# Altium schematic sheet i2c_diff.SchDoc
size A
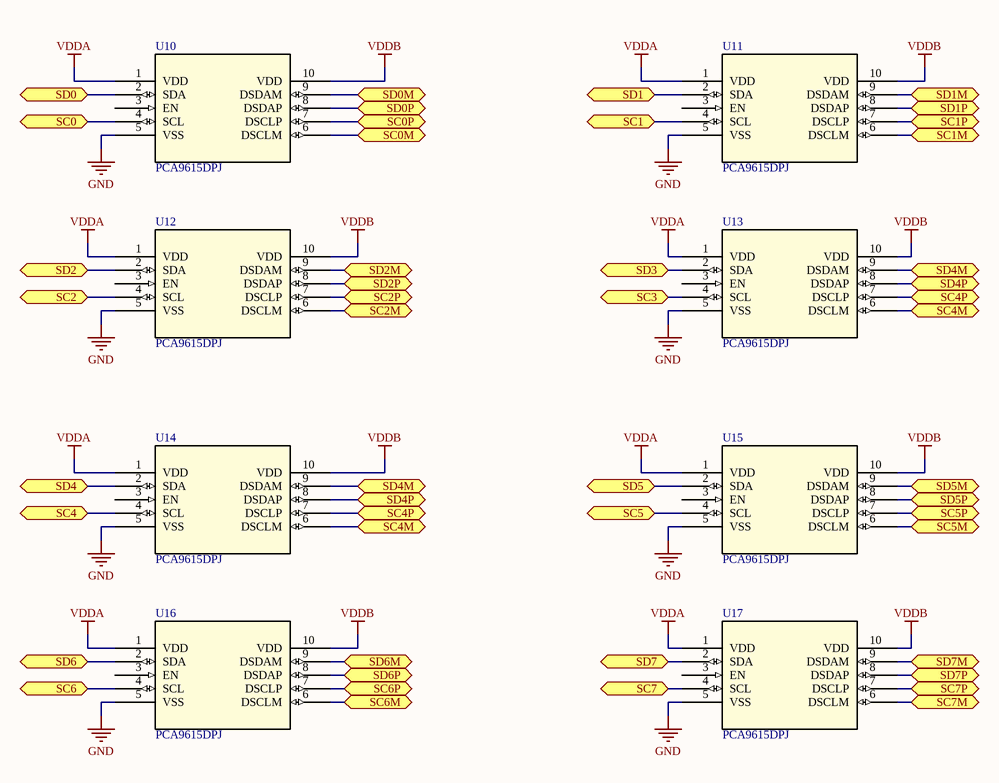
[diagram p0: i2c_diff.SchDoc]

## Parts
U10  PCA9615DPJ  [TSSOP10_3P1X3P1_NXP]
U11  PCA9615DPJ  [TSSOP10_3P1X3P1_NXP]
U12  PCA9615DPJ  [TSSOP10_3P1X3P1_NXP]
U13  PCA9615DPJ  [TSSOP10_3P1X3P1_NXP]
U14  PCA9615DPJ  [TSSOP10_3P1X3P1_NXP]
U15  PCA9615DPJ  [TSSOP10_3P1X3P1_NXP]
U16  PCA9615DPJ  [TSSOP10_3P1X3P1_NXP]
U17  PCA9615DPJ  [TSSOP10_3P1X3P1_NXP]

## Ports
SC0 (bidir), SC0M (bidir), SC0P (bidir), SC1 (bidir), SC1M (bidir), SC1P (bidir), SC2 (bidir), SC2M (bidir), SC2P (bidir), SC3 (bidir), SC4 (bidir), SC4M (bidir), SC4P (bidir), SC5 (bidir), SC5M (bidir), SC5P (bidir), SC6 (bidir), SC6M (bidir), SC6P (bidir), SC7 (bidir), SC7M (bidir), SC7P (bidir), SD0 (bidir), SD0M (bidir), SD0P (bidir), SD1 (bidir), SD1M (bidir), SD1P (bidir), SD2 (bidir), SD2M (bidir), SD2P (bidir), SD3 (bidir), SD4 (bidir), SD4M (bidir), SD4P (bidir), SD5 (bidir), SD5M (bidir), SD5P (bidir), SD6 (bidir), SD6M (bidir), SD6P (bidir), SD7 (bidir), SD7M (bidir), SD7P (bidir)

## Nets
GND: U10.5(VSS) U11.5(VSS) U12.5(VSS) U13.5(VSS) U14.5(VSS) U15.5(VSS) U16.5(VSS) U17.5(VSS)
VDDA: U10.1(VDD) U11.1(VDD) U12.1(VDD) U13.1(VDD) U14.1(VDD) U15.1(VDD) U16.1(VDD) U17.1(VDD)
VDDB: U10.10(VDD) U11.10(VDD) U12.10(VDD) U13.10(VDD) U14.10(VDD) U15.10(VDD) U16.10(VDD) U17.10(VDD)
SC0: U10.4(SCL) ; port SC0
SC0M: U10.6(DSCLM) ; port SC0M
SC0P: U10.7(DSCLP) ; port SC0P
SC1: U11.4(SCL) ; port SC1
SC1M: U11.6(DSCLM) ; port SC1M
SC1P: U11.7(DSCLP) ; port SC1P
SC2: U12.4(SCL) ; port SC2
SC2M: U12.6(DSCLM) ; port SC2M
SC2P: U12.7(DSCLP) ; port SC2P
SC3: U13.4(SCL) ; port SC3
SC4: U14.4(SCL) ; port SC4
SC4M: U13.6(DSCLM) U14.6(DSCLM) ; port SC4M
SC4P: U13.7(DSCLP) U14.7(DSCLP) ; port SC4P
SC5: U15.4(SCL) ; port SC5
SC5M: U15.6(DSCLM) ; port SC5M
SC5P: U15.7(DSCLP) ; port SC5P
SC6: U16.4(SCL) ; port SC6
SC6M: U16.6(DSCLM) ; port SC6M
SC6P: U16.7(DSCLP) ; port SC6P
SC7: U17.4(SCL) ; port SC7
SC7M: U17.6(DSCLM) ; port SC7M
SC7P: U17.7(DSCLP) ; port SC7P
SD0: U10.2(SDA) ; port SD0
SD0M: U10.9(DSDAM) ; port SD0M
SD0P: U10.8(DSDAP) ; port SD0P
SD1: U11.2(SDA) ; port SD1
SD1M: U11.9(DSDAM) ; port SD1M
SD1P: U11.8(DSDAP) ; port SD1P
SD2: U12.2(SDA) ; port SD2
SD2M: U12.9(DSDAM) ; port SD2M
SD2P: U12.8(DSDAP) ; port SD2P
SD3: U13.2(SDA) ; port SD3
SD4: U14.2(SDA) ; port SD4
SD4M: U13.9(DSDAM) U14.9(DSDAM) ; port SD4M
SD4P: U13.8(DSDAP) U14.8(DSDAP) ; port SD4P
SD5: U15.2(SDA) ; port SD5
SD5M: U15.9(DSDAM) ; port SD5M
SD5P: U15.8(DSDAP) ; port SD5P
SD6: U16.2(SDA) ; port SD6
SD6M: U16.9(DSDAM) ; port SD6M
SD6P: U16.8(DSDAP) ; port SD6P
SD7: U17.2(SDA) ; port SD7
SD7M: U17.9(DSDAM) ; port SD7M
SD7P: U17.8(DSDAP) ; port SD7P

Not connected (* = marked no-connect by the designer): U10 3(EN); U11 3(EN); U12 3(EN); U13 3(EN); U14 3(EN); U15 3(EN); U16 3(EN); U17 3(EN)

## Library data of the parts
U10-U17 = PCA9615DPJ: No Description Available; Mfr_Name: NXP; Copyright: Copyright (C) 2022 Ultra Librarian. All rights reserved.; Manufacturer_Part_Number: PCA9615DPJ; RefDes: RefDes; Type: DEV